# EAGLE design principal eagle balancer final (EAGLE 8.7.1)
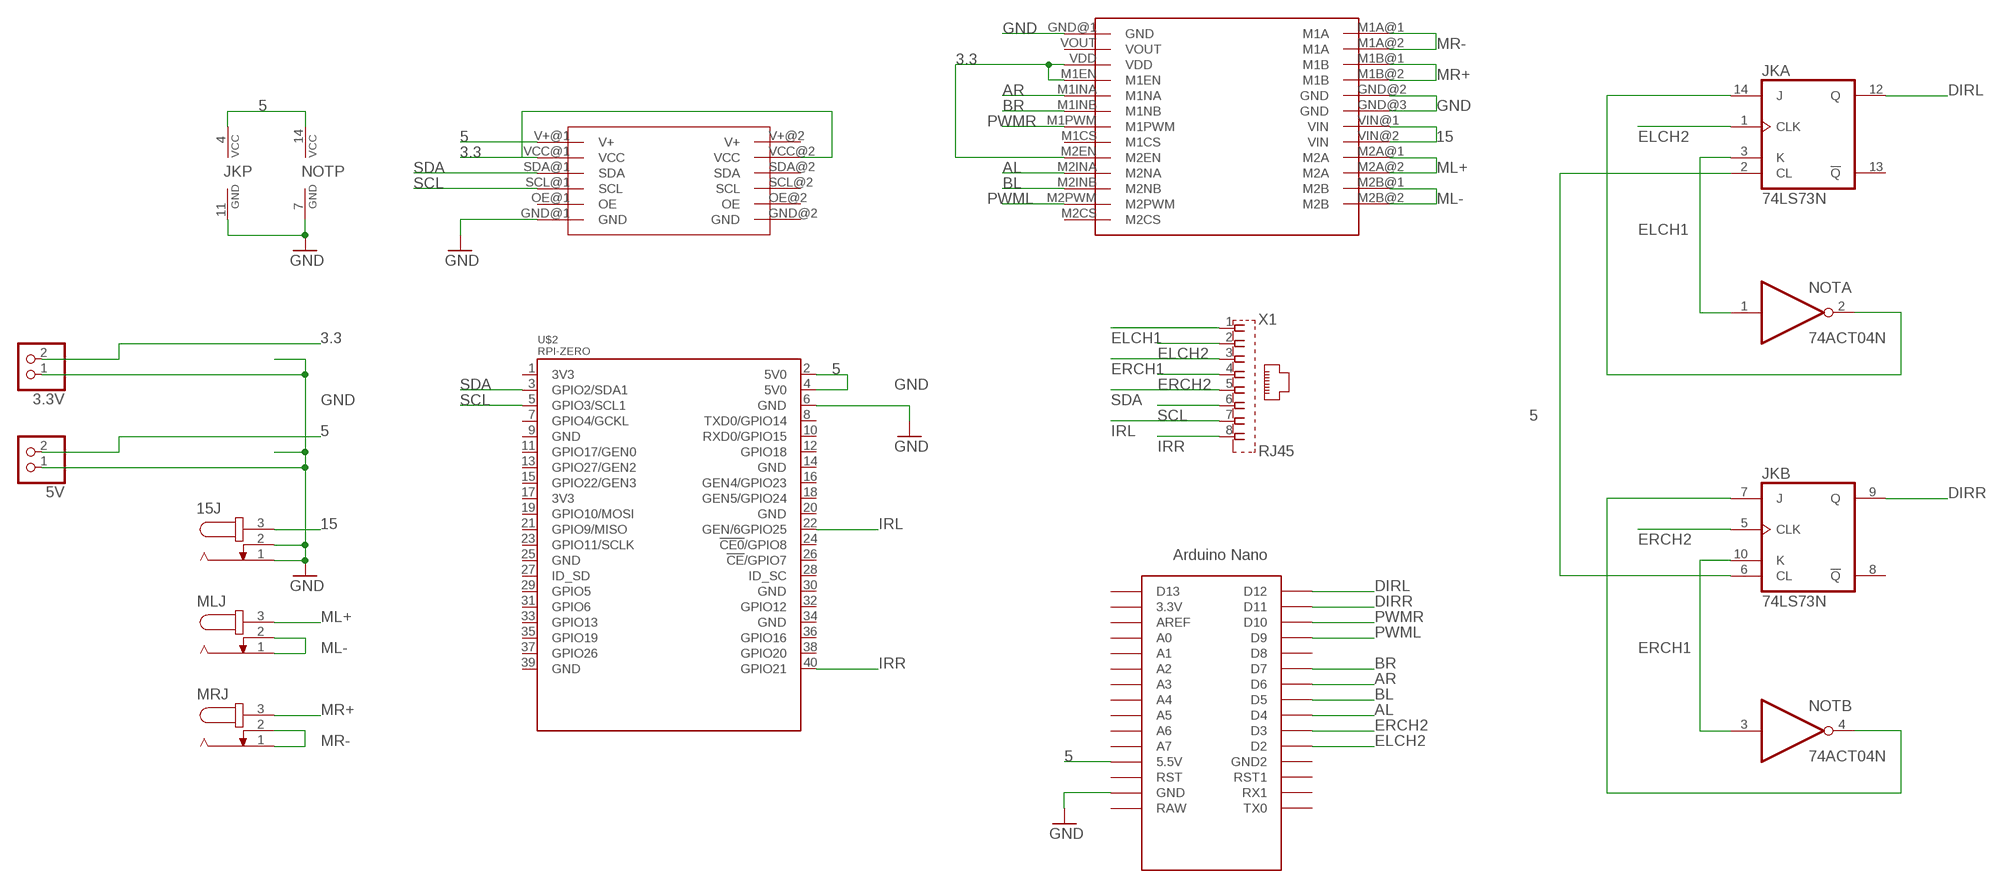
[diagram p0: schematic, sheet 1]

## Parts
3.3V  PINHD-1X2  [1X02]
5V  PINHD-1X2  [1X02]
15J  JACK-PLUG1  [SPC4078]
JK  74LS73N  [DIL14]
MLJ  JACK-PLUG1  [SPC4078]
MRJ  JACK-PLUG1  [SPC4078]
NOT  74ACT04N  [DIL14]
U$1  PCA  [PCA_P]
U$2  RPI-ZERO  [RASPBERRYPI_BASTELSTUBE_V13_RASPI_BOARD_B+_FULL]
U$3  VNH5019  [VNH5019_P]
U$4  NANO  [NANO]
X1  RJ45  [RJ45_P]

## Nets
3.3: 3.3V.2 U$1.VCC@1(VCC) U$1.VCC@2(VCC) U$3.M1EN U$3.M2EN U$3.VDD
5 [MOTORES]: 5V.2 JK.2(A:CL) JK.4(P:VCC) JK.6(B:CL) NOT.14(P:VCC) U$1.V+@1(V+) U$2.2(5V0) U$2.4(5V0) U$4.5V(5.5V)
15 [MOTORES]: 15J.3 U$3.VIN@1(VIN) U$3.VIN@2(VIN)
AL: U$3.M2INA(M2NA) U$4.D4
AR: U$3.M1INA(M1NA) U$4.D6
BL: U$3.M2INB(M2NB) U$4.D5
BR: U$3.M1INB(M1NB) U$4.D7
DIRL: JK.12(A:Q) U$4.D12
DIRR: JK.9(B:Q) U$4.D11
ELCH1: JK.3(A:K) NOT.1(A:I) X1.1
ELCH2: JK.1(A:CLK) U$4.D2 X1.2
ERCH1: JK.10(B:K) NOT.3(B:I) X1.3
ERCH2: JK.5(B:CLK) U$4.D3 X1.4
GND [MOTORES]: 3.3V.1 5V.1 15J.1 15J.2 JK.11(P:GND) NOT.7(P:GND) U$1.GND@1(GND) U$2.6(GND) U$3.GND@1(GND) U$3.GND@2(GND) U$3.GND@3(GND) U$4.GND
IRL: U$2.22(GEN/6GPIO25) X1.7
IRR: U$2.40(GPIO21) X1.8
ML+ [MOTORES]: MLJ.3 U$3.M2A@1(M2A) U$3.M2A@2(M2A)
ML- [MOTORES]: MLJ.1 MLJ.2 U$3.M2B@1(M2B) U$3.M2B@2(M2B)
MR+ [MOTORES]: MRJ.3 U$3.M1B@1(M1B) U$3.M1B@2(M1B)
MR- [MOTORES]: MRJ.1 MRJ.2 U$3.M1A@1(M1A) U$3.M1A@2(M1A)
N$1: JK.14(A:J) NOT.2(A:O)
N$2: JK.7(B:J) NOT.4(B:O)
PWML: U$3.M2PWM U$4.D9
PWMR: U$3.M1PWM U$4.D10
SCL: U$1.SCL@1(SCL) U$2.5(GPIO3/SCL1) X1.6
SDA: U$1.SDA@1(SDA) U$2.3(GPIO2/SDA1) X1.5
Unconnected: JK.8(B:!Q) JK.13(A:!Q) NOT.5(C:I) NOT.6(C:O) NOT.8(D:O) NOT.9(D:I) NOT.10(E:O) NOT.11(E:I) NOT.12(F:O) NOT.13(F:I) U$1.GND@2(GND) U$1.OE@1(OE) U$1.OE@2(OE) U$1.SCL@2(SCL) U$1.SDA@2(SDA) U$1.V+@2(V+) U$2.1(3V3) U$2.7(GPIO4/GCKL) U$2.8(TXD0/GPIO14) U$2.9(GND) U$2.10(RXD0/GPIO15) U$2.11(GPIO17/GEN0) U$2.12(GPIO18) U$2.13(GPIO27/GEN2) U$2.14(GND) U$2.15(GPIO22/GEN3) U$2.16(GEN4/GPIO23) U$2.17(3V3) U$2.18(GEN5/GPIO24) U$2.19(GPIO10/MOSI) U$2.20(GND) U$2.21(GPIO9/MISO) U$2.23(GPIO11/SCLK) U$2.24(!CE0!/GPIO8) U$2.25(GND) U$2.26(!CE!/GPIO7) U$2.27(ID_SD) U$2.28(ID_SC) U$2.29(GPIO5) U$2.30(GND) U$2.31(GPIO6) U$2.32(GPIO12) U$2.33(GPIO13) U$2.34(GND) U$2.35(GPIO19) U$2.36(GPIO16) U$2.37(GPIO26) U$2.38(GPIO20) U$2.39(GND) U$3.M1CS U$3.M2CS U$3.VOUT U$4.3.3V U$4.A0 U$4.A1 U$4.A2 U$4.A3 U$4.A4 U$4.A5 U$4.A6 U$4.A7 U$4.AREF U$4.D8 U$4.D13 U$4.GND1(GND2) U$4.ICSP1 U$4.ICSP2 U$4.ICSP3 U$4.ICSP4 U$4.ICSP5 U$4.ICSP6 U$4.RAW U$4.RST U$4.RST1 U$4.RX1 U$4.TX0

## Library data of the parts
3.3V 5V = pinhead:PINHD-1X2: PIN HEADER
15J MLJ MRJ = con-jack:JACK-PLUG: DC POWER JACK Power Jack, DC, Right Angle, Through Hole, Rated 5A at 16VDC, PC Terminals Distributor: Farnell (www.Farnell.de) Drawing: 84N1161.pdf / 84N1162.pdf Manufacturer: SPC Technology (www.spctechnology.com) Type: SPC4077 / SPC 4078; OC_FARNELL: unknown; OC_NEWARK: unknown
JK = 74xx-eu:74*73: Dual J-K FLIP FLOP, clear
NOT = 74xx-eu:74*04: Hex INVERTER
U$1 = DROIDLIRARY:PCA: Using only two pins, control 16 free-running PWM outputs! You can even chain up 62 breakouts to control up to 992 PWM outputs. It’s an i2c-controlled PWM driver with a built in clock. That means that, unlike the TLC5940 family, you do not need to continuously send it signal tying up your microcontroller, its completely free running! It is 5V compliant, which means you can control it from a 3.3V microcontroller and still safely drive up to 6V outputs (this is good for when you want to control white or blue LEDs with 3.4 forward voltages) 6 address select pins so you can wire up to 62 of these on a single i2c bus, a total of 992 outputs – that’s a lot of servos or LEDs Adjustable frequency PWM up to about 1.6 KHz 12-bit resolution for each output – for servos, that means about 4us resolution at 60Hz update rate Configurable push-pull or open-drain output Output enable pin to quickly disable all the outputs
U$2 = DROIDLIRARY:RPI-ZERO: rpi ZERO
U$3 = DROIDLIRARY:VNH5019: Pololu Dual motor drive shield
U$4 = DROIDLIRARY:NANO: Arduino Nano
X1 = DROIDLIRARY:RJ45: PULSEJACK (TM) 1x1 Tab-UP RJ45 10/100 Base-TX RJ45 1x1 Tab-UP with LEDs 8-pin (J1 series) and 6-pin (JP series) integrated magnetics connector, designed to support applications, such as ADSL modems, LAN-on-Motherboard, and Hub and Switches. Source: www.pulseeng.com .. PulseJack-J402.pdf; OC_FARNELL: unknown; OC_NEWARK: unknown

## Net classes
0 default: width 0.508 mm
1 MOTORES: width 0.813 mm

## Board
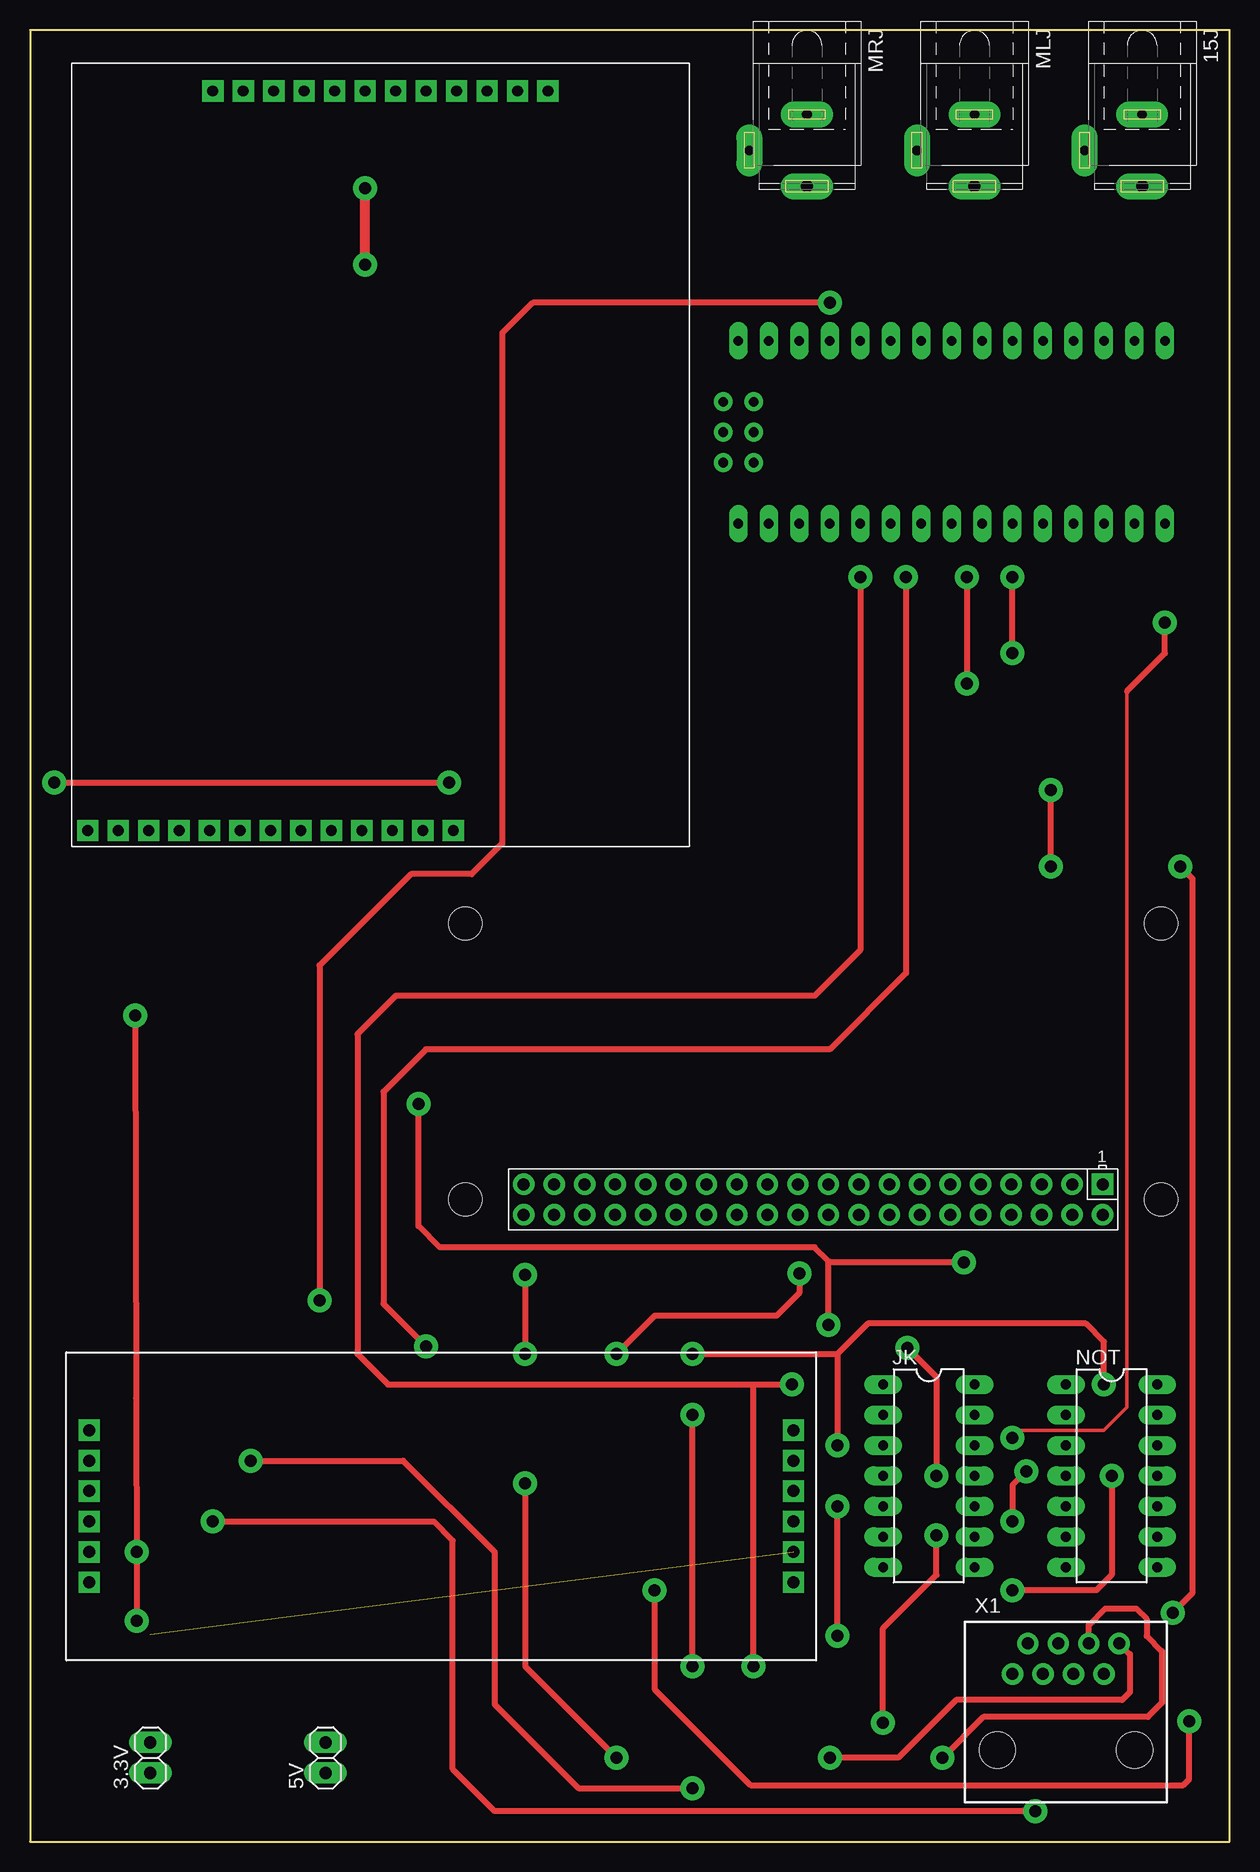
[diagram p1: board, top side]
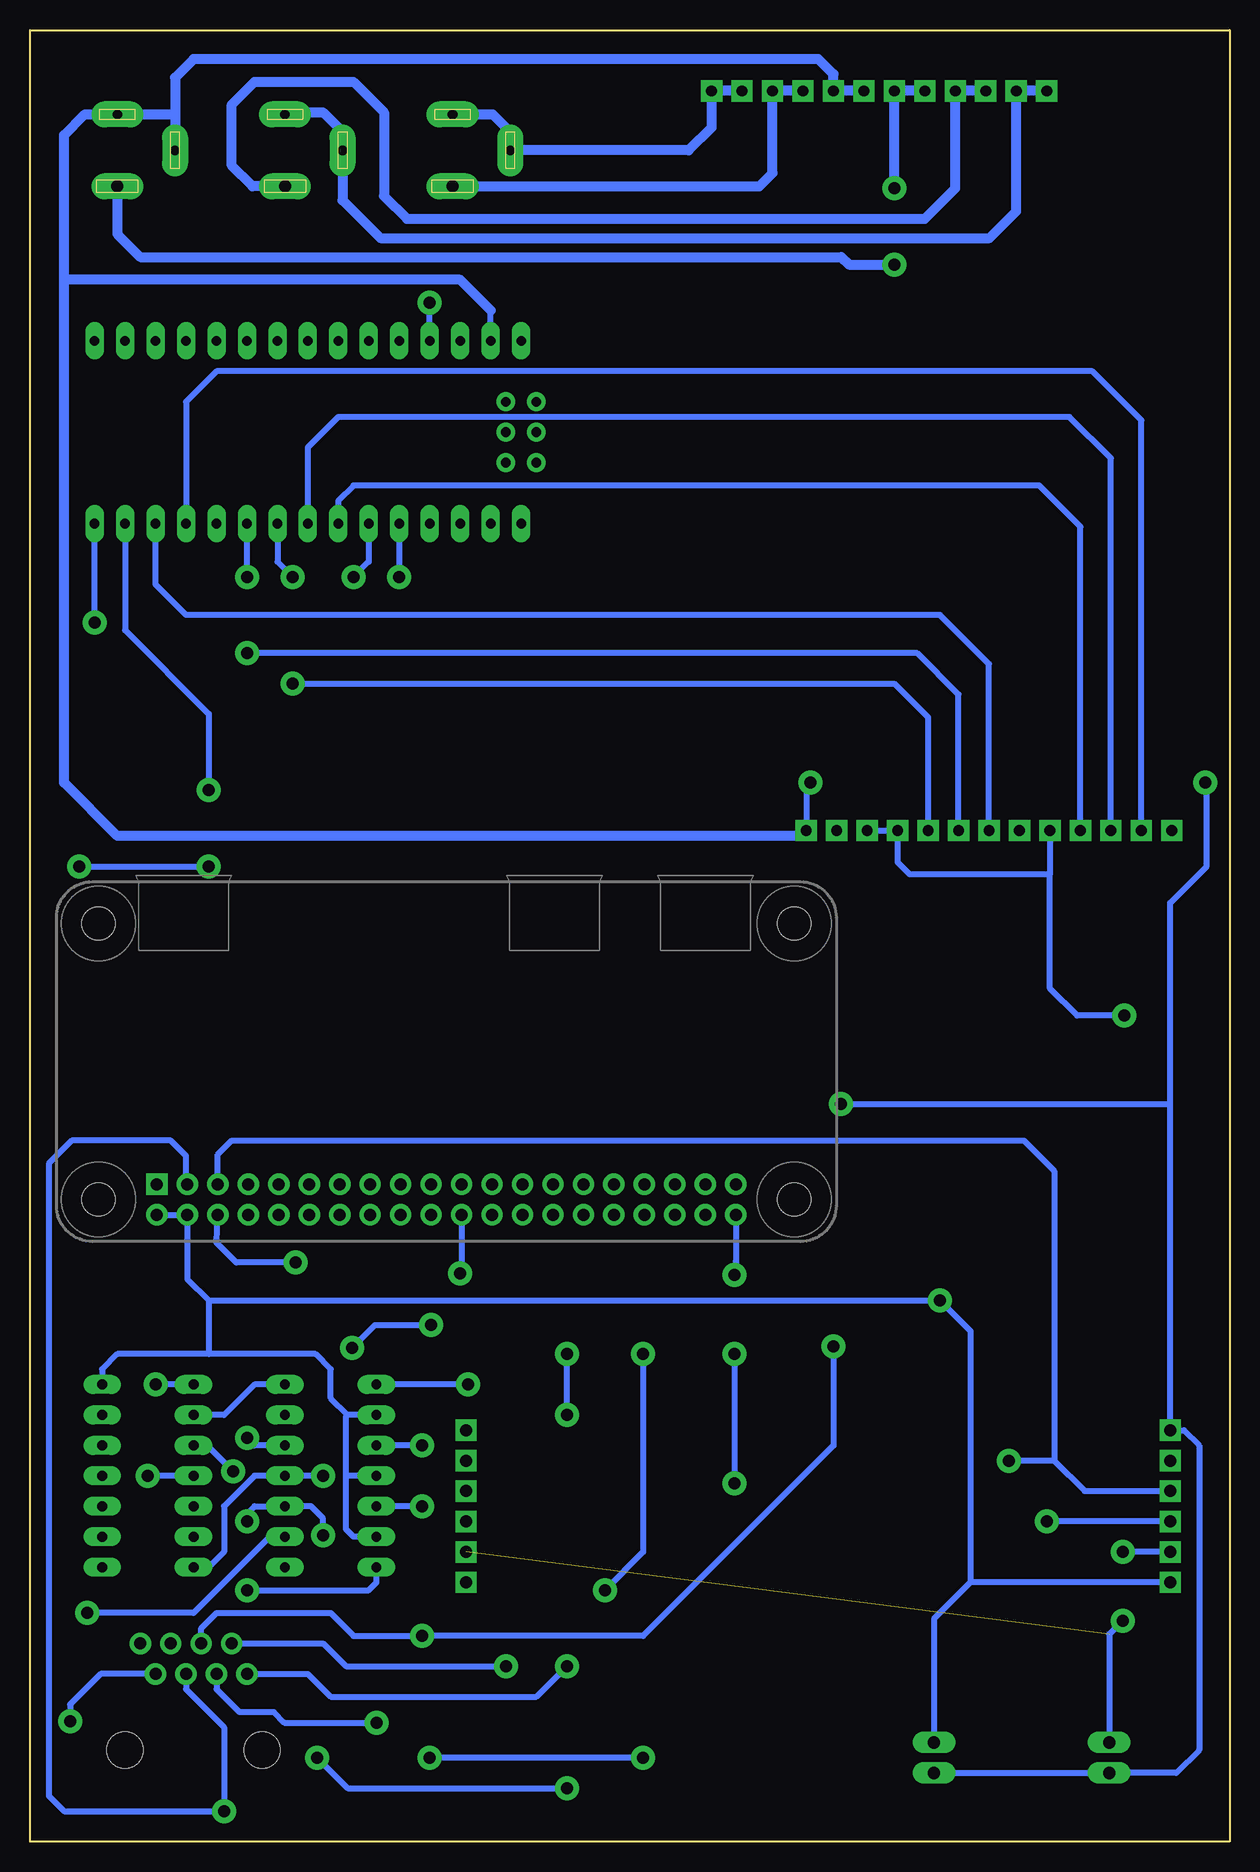
[diagram p2: board, bottom side, seen from below]

Size 100 x 151 mm. Coordinates in mm from the lower left corner, seen from the top.
Outline: 0,0 100,0 100,151 0,151 0,0
Copper layers (1*16): Top 0.035mm / dielectric 1.5mm / Bottom 0.035mm
Design rules "default *": minimum track width 6mil, minimum drill 0.35mm, track to track 6mil, track to pad 6mil, pad to pad 6mil, via to via 6mil, smd to smd 6mil, copper to edge 40mil, drill to drill 6mil, minimum pad ring 15mil, minimum via ring 10mil, stop-mask expansion 4mil, vias tented up to drill 0mil, thermal gap 10mil

### Footprints (pad centres in the part's own frame; a part is rotated, then mirrored left to right if it is on the bottom)
1X02 = drill 1.016 long: 1 -1.27,0; 2 1.27,0
SPC4078 = drill 0.8 pad 2.184 long: 1 -3,0; 2 0,-4.8 | drill 1 pad 2.184 long: 3 3,0
DIL14 = drill 0.813 long: 1 -7.62,-3.81; 2 -5.08,-3.81; 3 -2.54,-3.81; 4 0,-3.81; 5 2.54,-3.81; 6 5.08,-3.81; 7 7.62,-3.81; 8 7.62,3.81; 9 5.08,3.81; 10 2.54,3.81; 11 0,3.81; 12 -2.54,3.81; 13 -5.08,3.81; 14 -7.62,3.81
PCA_P = drill 1 pad 1.676 square: GND@1 -29.35,6.35; GND@2 29.35,6.35; OE@1 -29.35,3.81; OE@2 29.35,3.81; SCL@1 -29.35,1.27; SCL@2 29.35,1.27; SDA@1 -29.35,-1.27; SDA@2 29.35,-1.27; V+@1 -29.35,-6.35; V+@2 29.35,-6.35; VCC@1 -29.35,-3.81; VCC@2 29.35,-3.81
RASPBERRYPI_BASTELSTUBE_V13_RASPI_BOARD_B+_FULL = drill 1 pad 1.778 square: 1 8.37,25.23 | drill 1 pad 1.778: 2 8.37,27.77; 3 10.91,25.23; 4 10.91,27.77; 5 13.45,25.23; 6 13.45,27.77; 7 15.99,25.23; 8 15.99,27.77; 9 18.53,25.23; 10 18.53,27.77; 11 21.07,25.23; 12 21.07,27.77; 13 23.61,25.23; 14 23.61,27.77; 15 26.15,25.23; 16 26.15,27.77; 17 28.69,25.23; 18 28.69,27.77; 19 31.23,25.23; 20 31.23,27.77; 21 33.77,25.23; 22 33.77,27.77; 23 36.31,25.23; 24 36.31,27.77; 25 38.85,25.23; 26 38.85,27.77; 27 41.39,25.23; 28 41.39,27.77; 29 43.93,25.23; 30 43.93,27.77; 31 46.47,25.23; 32 46.47,27.77; 33 49.01,25.23; 34 49.01,27.77; 35 51.55,25.23; 36 51.55,27.77; 37 54.09,25.23; 38 54.09,27.77; 39 56.63,25.23; 40 56.63,27.77 | hole 2.75: 3.5,3.5; 3.5,26.5; 61.5,3.5; 61.5,26.5
VNH5019_P = drill 0.9 pad 1.778 square: GND@1 31.3,6.08; GND@2 -30.35,3.81; GND@3 -30.35,1.27; M1A@1 -30.35,13.97; M1A@2 -30.35,11.43; M1B@1 -30.35,8.89; M1B@2 -30.35,6.35; M1CS 31.3,-11.7; M1EN 31.3,-1.54; M1INA 31.3,-4.08; M1INB 31.3,-6.62; M1PWM 31.3,-9.16; M2A@1 -30.35,-6.35; M2A@2 -30.35,-8.89; M2B@1 -30.35,-11.43; M2B@2 -30.35,-13.97; M2CS 31.3,-24.4; M2EN 31.3,-14.24; M2INA 31.3,-16.78; M2INB 31.3,-19.32; M2PWM 31.3,-21.86; VDD 31.3,1; VIN@1 -30.35,-1.27; VIN@2 -30.35,-3.81; VOUT 31.3,3.54
NANO = drill 0.8 long: 3.3V -10.16,24.13; 5V -10.16,-1.27; A0 -10.16,19.05; A1 -10.16,16.51; A2 -10.16,13.97; A3 -10.16,11.43; A4 -10.16,8.89; A5 -10.16,6.35; A6 -10.16,3.81; A7 -10.16,1.27; AREF -10.16,21.59; D2 5.08,1.27; D3 5.08,3.81; D4 5.08,6.35; D5 5.08,8.89; D6 5.08,11.43; D7 5.08,13.97; D8 5.08,16.51; D9 5.08,19.05; D10 5.08,21.59; D11 5.08,24.13; D12 5.08,26.67; D13 -10.16,26.67; GND -10.16,-6.35; GND1 5.08,-1.27; RAW -10.16,-8.89; RST -10.16,-3.81; RST1 5.08,-3.81; RX1 5.08,-6.35; TX0 5.08,-8.89 | drill 0.8: ICSP1 -5.08,-10.16; ICSP2 -5.08,-7.62; ICSP3 -2.54,-10.16; ICSP4 -2.54,-7.62; ICSP5 0,-10.16; ICSP6 0,-7.62
RJ45_P = drill 1 pad 1.778: 1 -4.445,3.81; 2 -3.175,6.35; 3 -1.905,3.81; 4 -0.635,6.35; 5 0.635,3.81; 6 1.905,6.35; 7 3.175,3.81; 8 4.445,6.35 | hole 3: 5.715,-2.54; -5.715,-2.54

### Placement (x,y rotation side)
3.3V  10.03,6.99 90 top
5V  24.64,6.99 90 top
15J  92.71,140.97 270 top
JK  74.93,30.48 270 top
MLJ  78.74,140.97 270 top
MRJ  64.77,140.97 270 top
NOT  90.17,30.48 270 top
U$1  34.29,27.94 0 top
U$2  97.79,80.01 180 top
U$3  29.21,115.57 270 top
U$4  67.94,114.94 270 top
X1  86.36,10.16 0 top

### Tracks (layer width: path | path; a pad name or v marks a point on that pad's centre or on a via)
3.3  (via drill 1 pad 2)  (1 unrouted)
  Top 0.508: v8.89,18.41 v8.89,24.13 8.86,35.05 | v8.76,68.83 8.85,36.96 8.86,35.05 | 8.86,35.05
  Bottom 0.508: U$1.VCC@1 v8.89,24.13 | U$3.VDD U$3.M1EN 27.67,81.64 26.67,80.64 14.97,80.64 | U$3.M2EN 14.97,80.64 | v8.76,68.83 12.7,68.83 14.97,71.1 14.97,80.64 | v8.89,18.41 10.03,17.27 3.3V.2
5  (via drill 1 pad 2)
  Top 0.508: v66.67,128.27 41.91,128.27 39.37,125.73 39.37,83.19 36.83,80.64 31.75,80.64 24.13,73.03 v24.13,45.09
  Bottom 0.508: U$1.V+@1 21.59,21.59 | U$2.2 U$2.4 86.88,46.88 85.09,45.09 | U$4.5V v66.67,128.27 | 85.09,45.09 v24.13,45.09 21.59,42.55 21.59,21.59 | 21.59,21.59 24.64,18.54 5V.2 | 85.09,40.64 76.2,40.64 74.93,39.37 74.93,36.96 73.53,35.56 | 85.09,40.64 92.71,40.64 93.98,39.37 NOT.14 | JK.2 73.53,35.56 | JK.6 73.03,25.4 73.66,26.04 73.66,30.61 | 73.66,30.61 73.66,35.43 73.53,35.56 | 85.09,45.09 85.09,40.64 | JK.4 73.53,30.48 73.66,30.61
15  (via drill 1 pad 2)
  Top 0.813: v27.94,131.44 v27.94,137.79
  Bottom 0.813: U$3.VIN@2 U$3.VIN@1 v27.94,137.79 | v27.94,131.44 31.75,131.44 32.38,132.08 90.81,132.08 92.71,133.99 15J.3
AL
  Bottom 0.508: U$3.M2INA 12.43,109.58 15.88,113.03 73.03,113.03 74.3,111.76 U$4.D4
AR  (via drill 1 pad 2)
  Top 0.508: v78.11,105.41 v78.11,96.52
  Bottom 0.508: U$4.D6 79.38,106.68 v78.11,105.41 | U$3.M1INA 25.13,93.71 27.94,96.52 v78.11,96.52
BL
  Bottom 0.508: U$4.D5 76.83,116.2 74.3,118.75 13.34,118.75 9.89,115.3 U$3.M2INB
BR  (via drill 1 pad 2)
  Top 0.508: v81.92,99.06 v81.92,105.41
  Bottom 0.508: U$3.M1INB 22.59,95.61 26.04,99.06 v81.92,99.06 | v81.92,105.41 U$4.D7
DIRL  (via drill 1 pad 2)
  Top 0.305: 91.44,95.89 91.44,36.2 89.53,34.29 82.55,34.29 v81.92,33.66
  Top 0.508: 91.44,95.89 94.61,99.06 v94.61,101.6
  Bottom 0.508: v94.61,101.6 U$4.D12 | JK.12 81.28,33.02 v81.92,33.66
DIRR  (via drill 1 pad 2)
  Top 0.508: v95.25,19.05 96.94,20.73 96.94,80.23 v95.89,81.28 | v85.09,81.28 v85.09,87.63
  Bottom 0.508: U$4.D11 92.08,100.97 85.09,93.98 v85.09,87.63 | JK.9 80.01,25.4 86.36,19.05 v95.25,19.05 | v95.89,81.28 v85.09,81.28
ELCH1  (via drill 1 pad 2)
  Top 0.508: v89.53,38.1 89.53,41.66 88.01,43.18 69.85,43.18 67.31,40.64 | 67.31,40.64 v67.31,33.02 | v55.24,14.61 v55.24,35.56 | v55.24,40.64 67.31,40.64
  Bottom 0.508: NOT.1 v89.53,38.1 | v67.31,33.02 JK.3 | X1.1 76.83,13.97 74.93,12.06 57.78,12.06 v55.24,14.61 | v55.24,35.56 v55.24,40.64
ELCH2  (via drill 1 pad 2)
  Top 0.508: v69.22,105.41 69.22,74.3 65.41,70.48 30.48,70.48 27.3,67.31 27.3,40.64 29.84,38.1 60.33,38.1 | 60.33,38.1 v63.5,38.1 | v60.33,14.61 60.33,38.1
  Bottom 0.508: U$4.D2 v69.22,105.41 | v63.5,38.1 JK.1 | v60.33,14.61 73.66,14.61 75.56,16.51 X1.2
ERCH1  (via drill 1 pad 2)
  Top 0.508: v71.12,9.91 71.12,17.78 75.56,22.23 v75.56,25.53 | v83.06,30.86 81.92,29.72 v81.92,26.67
  Bottom 0.508: X1.3 84.45,12.7 82.55,10.79 79.69,10.79 78.8,9.91 v71.12,9.91 | v81.92,26.67 81.92,27.3 81.28,27.94 JK.10 76.58,27.94 75.56,26.92 v75.56,25.53 | v83.06,30.86 85.22,33.02 NOT.3
ERCH2  (via drill 1 pad 2)
  Top 0.508: v73.03,105.41 73.03,72.39 66.67,66.04 33.02,66.04 29.46,62.48 29.46,44.83 v33.02,41.27 | v67.31,17.14 v67.31,27.94
  Bottom 0.508: v73.03,105.41 71.75,106.68 U$4.D3 | v33.02,41.27 33.02,33.02 48.9,17.14 v67.31,17.14 73.03,17.14 74.93,19.05 84.45,19.05 85.72,17.78 X1.4 | v67.31,27.94 JK.5
GND  (via drill 1 pad 2)
  Top 0.508: v2.02,88.27 v34.92,88.27 | v66.55,43.05 66.55,48.39 | 48.77,49.53 48.78,49.54 | 48.77,49.53 34.16,49.53 32.38,51.31 v32.38,61.47 | v75.56,30.48 75.56,38.73 v73.15,41.15 | v77.85,48.26 66.67,48.26 66.55,48.39 | 66.55,48.39 65.41,49.53 48.77,49.53
  Bottom 0.508: NOT.7 85.09,22.86 83.82,24.13 83.82,27.94 81.28,30.48 JK.11 v75.56,30.48 | 35.74,83.82 U$3.GND@1 35.29,87.9 v34.92,88.27 | U$4.GND 61.59,127.64 | 4.94,61.34 U$1.GND@1 3.81,34.29 2.54,33.02 2.54,7.62 4.45,5.71 3.3V.1 5V.1 | 4.94,61.34 4.94,78.25 1.91,81.28 1.91,88.15 v2.02,88.27 | v73.15,41.15 71.25,43.05 v66.55,43.05 | v32.38,61.47 5.07,61.47 4.94,61.34 | U$2.6 84.44,49.91 82.79,48.26 v77.85,48.26
  Bottom 0.813: U$3.GND@3 U$3.GND@2 33.02,147.32 34.28,148.58 86.37,148.58 87.91,147.04 87.91,144.15 | 87.91,144.15 15J.2 | 87.91,144.15 88.08,143.97 15J.1 95.42,143.97 97.16,142.24 97.16,130.18 | 35.74,83.82 92.71,83.82 97.16,88.27 97.16,130.18 | 61.59,127.64 64.14,130.18 97.16,130.18
IRL  (via drill 1 pad 2)
  Top 0.508: v64.14,47.37 64.14,45.72 62.23,43.81 52.07,43.81 v48.9,40.64 | v52.07,20.95 52.07,12.7 60.07,4.7 96.14,4.7 96.64,5.2 96.64,9.93 v96.65,10.03
  Bottom 0.508: U$2.22 64.02,48.38 v64.14,47.37 | v48.9,40.64 48.9,24.13 v52.07,20.95 | X1.7 94.11,13.97 96.65,11.43 v96.65,10.03
IRR  (via drill 1 pad 2)
  Top 0.508: v41.27,47.24 v41.27,40.64 | v41.27,29.84 41.27,14.61 v48.9,6.99 | v66.67,6.99 72.39,6.99 77.22,11.81 91.06,11.81 91.69,12.45 91.69,15.62 X1.8
  Bottom 0.508: U$2.40 41.16,48.38 v41.27,47.24 | v41.27,40.64 v41.27,29.84 | v48.9,6.99 v66.67,6.99
ML+
  Bottom 0.813: U$3.M2A@2 U$3.M2A@1 22.86,137.79 25.4,135.25 68.58,135.25 70.48,137.16 70.48,144.15 73.03,146.69 81.28,146.69 83.19,144.78 83.19,139.7 81.45,137.97 MLJ.3
ML-
  Bottom 0.813: U$3.M2B@2 U$3.M2B@1 17.78,135.89 20.02,133.66 70.79,133.66 73.94,136.81 MLJ.2 73.94,142.52 75.56,144.15 78.56,144.15 MLJ.1
MR+
  Bottom 0.813: U$3.M1B@2 U$3.M1B@1 38.1,139.06 39.2,137.97 MRJ.3
MR-
  Bottom 0.813: U$3.M1A@2 U$3.M1A@1 43.18,142.88 45.09,140.97 MRJ.2 59.97,142.52 61.42,143.97 MRJ.1
N$1
  Bottom 0.508: JK.14 81.28,38.1 83.82,35.56 NOT.2
N$2  (via drill 1 pad 2)
  Top 0.508: v90.17,30.48 90.17,22.23 88.9,20.95 v81.92,20.95
  Bottom 0.508: NOT.4 v90.17,30.48 | v81.92,20.95 71.75,20.95 71.12,21.59 JK.7
PWML
  Bottom 0.508: U$3.M2PWM 7.35,118.47 11.43,122.56 84.45,122.56 87,120.02 U$4.D9
PWMR
  Bottom 0.508: U$3.M1PWM 20.05,98.16 24.13,102.23 87,102.23 89.53,104.78 U$4.D10
SCL  (via drill 1 pad 2)
  Top 0.508: v55.24,4.45 45.72,4.45 38.73,11.43 38.73,24.13 31.11,31.75 v18.41,31.75 | X1.6 88.27,18.03 89.66,19.43 92.2,19.43 93.09,18.54 93.09,17.14 94.36,15.88 94.36,11.56 93.19,10.39 79.5,10.39 76.09,6.99 v76.07,6.99
  Bottom 0.508: U$2.5 84.34,57.27 83.19,58.42 17.14,58.42 14.61,55.88 14.61,31.75 | 14.61,31.75 12.06,29.21 U$1.SCL@1 | 14.61,31.75 v18.41,31.75 | v76.07,6.99 73.53,4.45 v55.24,4.45
SDA  (via drill 1 pad 2)
  Top 0.508: v15.24,26.67 33.66,26.67 35.24,25.08 35.24,6.03 38.73,2.54 v83.82,2.54
  Bottom 0.508: U$2.3 87,54.9 87,57.15 88.27,58.42 96.52,58.42 98.42,56.52 98.42,3.81 97.16,2.54 v83.82,2.54 83.82,9.53 87,12.7 X1.5 | U$1.SDA@1 v15.24,26.67